# EAGLE schematic aquam60 (EAGLE 9.6.2)
DOCO_NUMBER: 4014 003; REV: 03; TITLE: AQUA M60

## Sheet 1 of 6
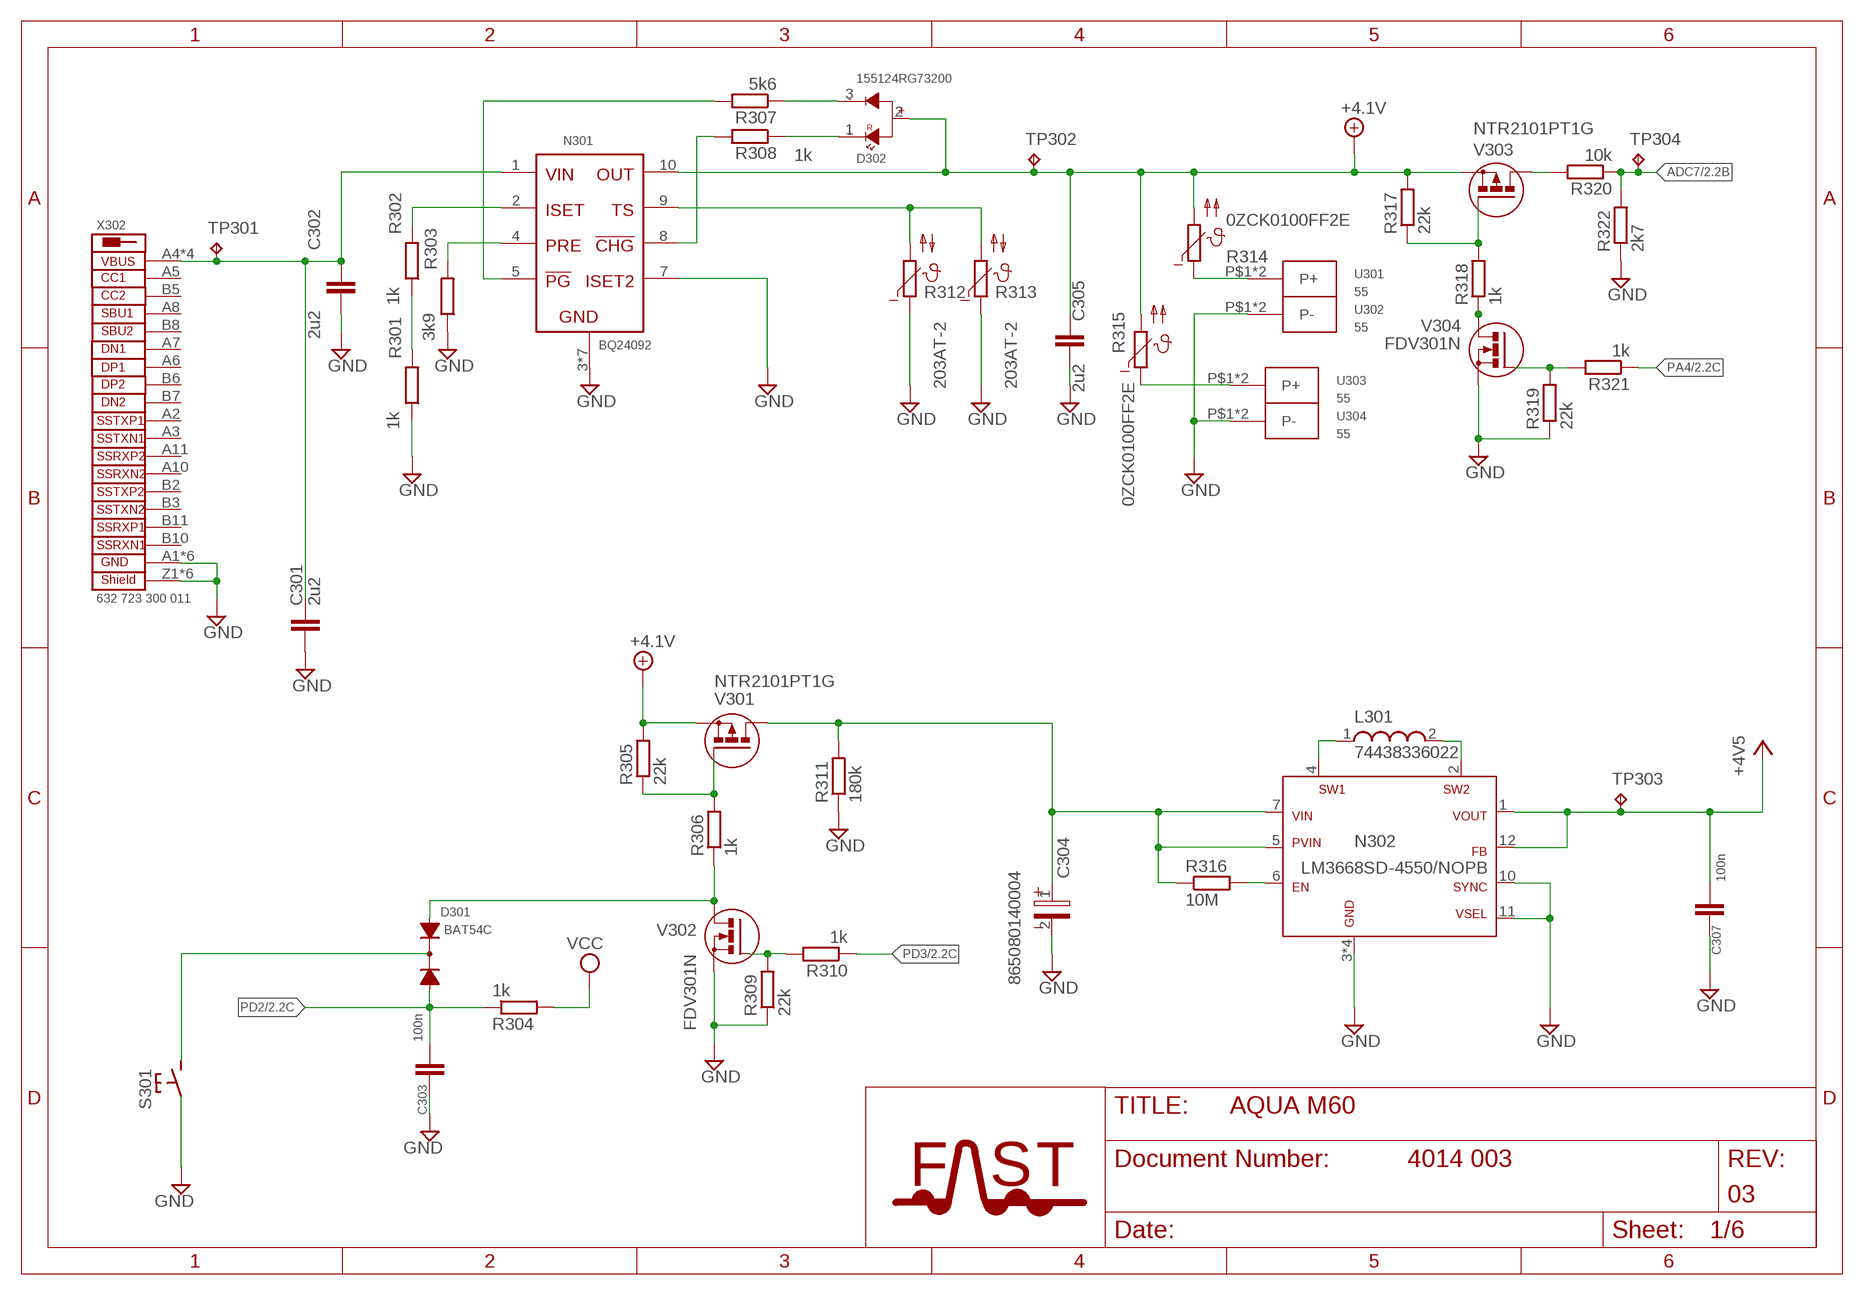
[diagram p0: schematic, sheet 1]

### Parts
C301  2u2  C-EUC0603  [C0603]
C302  2u2  C-EUC0603  [C0603]
C303  100n  C-EUC0603  [C0603]
C304  865080140004  WCAP-ASLI_4X5.5(DXL)  [2.6X1.6X1(BXCXA)]
C305  2u2  C-EUC0603  [C0603]
C307  100n  C-EUC0603  [C0603]
D301  BAT54C  BAT54C-1  [SOT23]
D302  155124RG73200  WL-SBSW_1204_155124RG73200  [WL-SBSW_1204]
L301  74438336022  WE-MAPI_3015/3020_STANDER  [WE-MAPI_3015/3020]
N301  BQ24092  BQ2409X  [HVSSOP10]
N302  LM3668SD-4550/NOPB  LM3668SD  [DFN_12POL_+0,2MM]
R301  1k  R-EU_R0603  [R0603]
R302  1k  R-EU_R0603  [R0603]
R303  3k9  R-EU_R0603  [R0603]
R304  1k  R-EU_R0603  [R0603]
R305  22k  R-EU_R0603  [R0603]
R306  1k  R-EU_R0603  [R0603]
R307  5k6  R-EU_R0603  [R0603]
R308  1k  R-EU_R0603  [R0603]
R309  22k  R-EU_R0603  [R0603]
R310  1k  R-EU_R0603  [R0603]
R311  180k  R-EU_R0603  [R0603]
R312  203AT-2  NTC  [AT-2]
R313  203AT-2  NTC  [AT-2]
R314  0ZCK0100FF2E  PTC  [R0805]
R315  0ZCK0100FF2E  PTC  [R0805]
R316  10M  R-EU_R0603  [R0603]
R317  22k  R-EU_R0603  [R0603]
R318  1k  R-EU_R0603  [R0603]
R319  22k  R-EU_R0603  [R0603]
R320  10k  R-EU_R0603  [R0603]
R321  1k  R-EU_R0603  [R0603]
R322  2k7  R-EU_R0603  [R0603]
S301  1301.9320  1301.93XX  [1301.93XX]
TP301  n.b.  TPTP10R  [TP10R]
TP302  n.b.  TPTP10R  [TP10R]
TP303  n.b.  TPTP10R  [TP10R]
TP304  n.b.  TPTP10R  [TP10R]
U301  55  55+  [55+]
U302  55  55--  [55-]
U303  55  55+  [55+]
U304  55  55--  [55-]
V301  NTR2101PT1G  P-MOSFET-SOT23  [SMDTR-1]
V302  FDV301N  N-MOSFET-SOT23  [SMDTR-1]
V303  NTR2101PT1G  P-MOSFET-SOT23  [SMDTR-1]
V304  FDV301N  N-MOSFET-SOT23  [SMDTR-1]
X302  632 723 300 011  USB_3.1_TYPE_C_4L  [632723300011_4L]

### Nets
+4.1V [V+]: C305.1 D302.2 N301.10(OUT) R305.2 R314.2 R315.2 R317.2 TP302.TP V301.2(S) V303.2(S)
+4V5 [VCC]: C307.2 N302.1(VOUT) N302.12(FB) TP303.TP ; also sheet 2,3,4
ADC7: R320.1 R322.2 TP304.TP ; also sheet 2
GND [GND]: C301.2 C302.2 C303.1 C304.2 C305.2 C307.1 N301.3(GND) N301.7(ISET2) N301.11(GND) N301.P$1(GND) N301.P$2(GND) N301.P$3(GND) N301.P$4(GND) N301.P$5(GND) N302.3(GND) N302.8(GND) N302.9(GND) N302.10(SYNC) N302.11(VSEL) N302.13(GND) R301.1 R303.1 R309.1 R311.1 R312.P$1 R313.P$1 R319.1 R322.1 S301.P1 S301.P2 U302.P$1(P-) U302.P$2(P-) U304.P$1(P-) U304.P$2(P-) V302.2(S) V304.2(S) X302.A1(GND) X302.A12(GND) X302.B1(GND) X302.B12(GND) X302.G3(GND) X302.G4(GND) X302.Z1(SHIELD) X302.Z2(SHIELD) X302.Z3(SHIELD) X302.Z4(SHIELD) X302.Z5(SHIELD) X302.Z6(SHIELD) ; also sheet 2,3,4,5,6
N$6: D302.3 R307.1
N$7: D302.1 R308.1
N$10: N301.8(!CHG!) R308.2
N$28 [V+]: R314.1 U301.P$1(P+) U301.P$2(P+)
N$29: C304.1 N302.5(PVIN) N302.7(VIN) R311.2 R316.1 V301.3(D)
N$32: D301.3(AK) S301.P3 S301.P4
N$40: R318.1 V304.3(D)
N$44: R317.1 R318.2 V303.1(G)
N$45: R319.2 R321.2 V304.1(G)
N$46 [V+]: C301.1 C302.1 N301.1(VIN) TP301.TP X302.A4(VBUS) X302.A9(VBUS) X302.B4(VBUS) X302.B9(VBUS)
N$47: N301.2(ISET) R302.2
N$48: R320.2 V303.3(D)
N$49: N301.4(PRE) R303.2
N$51: N301.9(TS) R312.P$2 R313.P$2
N$55: N301.5(!PG!) R307.2
N$56: N302.6(EN) R316.2
N$64: R305.1 R306.2 V301.1(G)
N$65: L301.1 N302.4(SW1)
N$66: D301.2(A2) R306.1 V302.3(D)
N$67: R309.2 R310.2 V302.1(G)
N$71: L301.2 N302.2(SW2)
N$73: R315.1 U303.P$1(P+) U303.P$2(P+)
N$74: R301.2 R302.1
PA4: R321.1 ; also sheet 2
PD2: C303.2 D301.1(A1) R304.1 ; also sheet 2
PD3: R310.1 ; also sheet 2
VCC [VCC]: R304.2 ; also sheet 2,4
Unconnected: X302.A2(SSTXP1) X302.A3(SSTXN1) X302.A5(CC1) X302.A6(DP1) X302.A7(DN1) X302.A8(SBU1) X302.A10(SSRXN2) X302.A11(SSRXP2) X302.B2(SSTXP2) X302.B3(SSTXN2) X302.B5(CC2) X302.B6(DP2) X302.B7(DN2) X302.B8(SBU2) X302.B10(SSRXN1) X302.B11(SSRXP1)

## Sheet 2 of 6
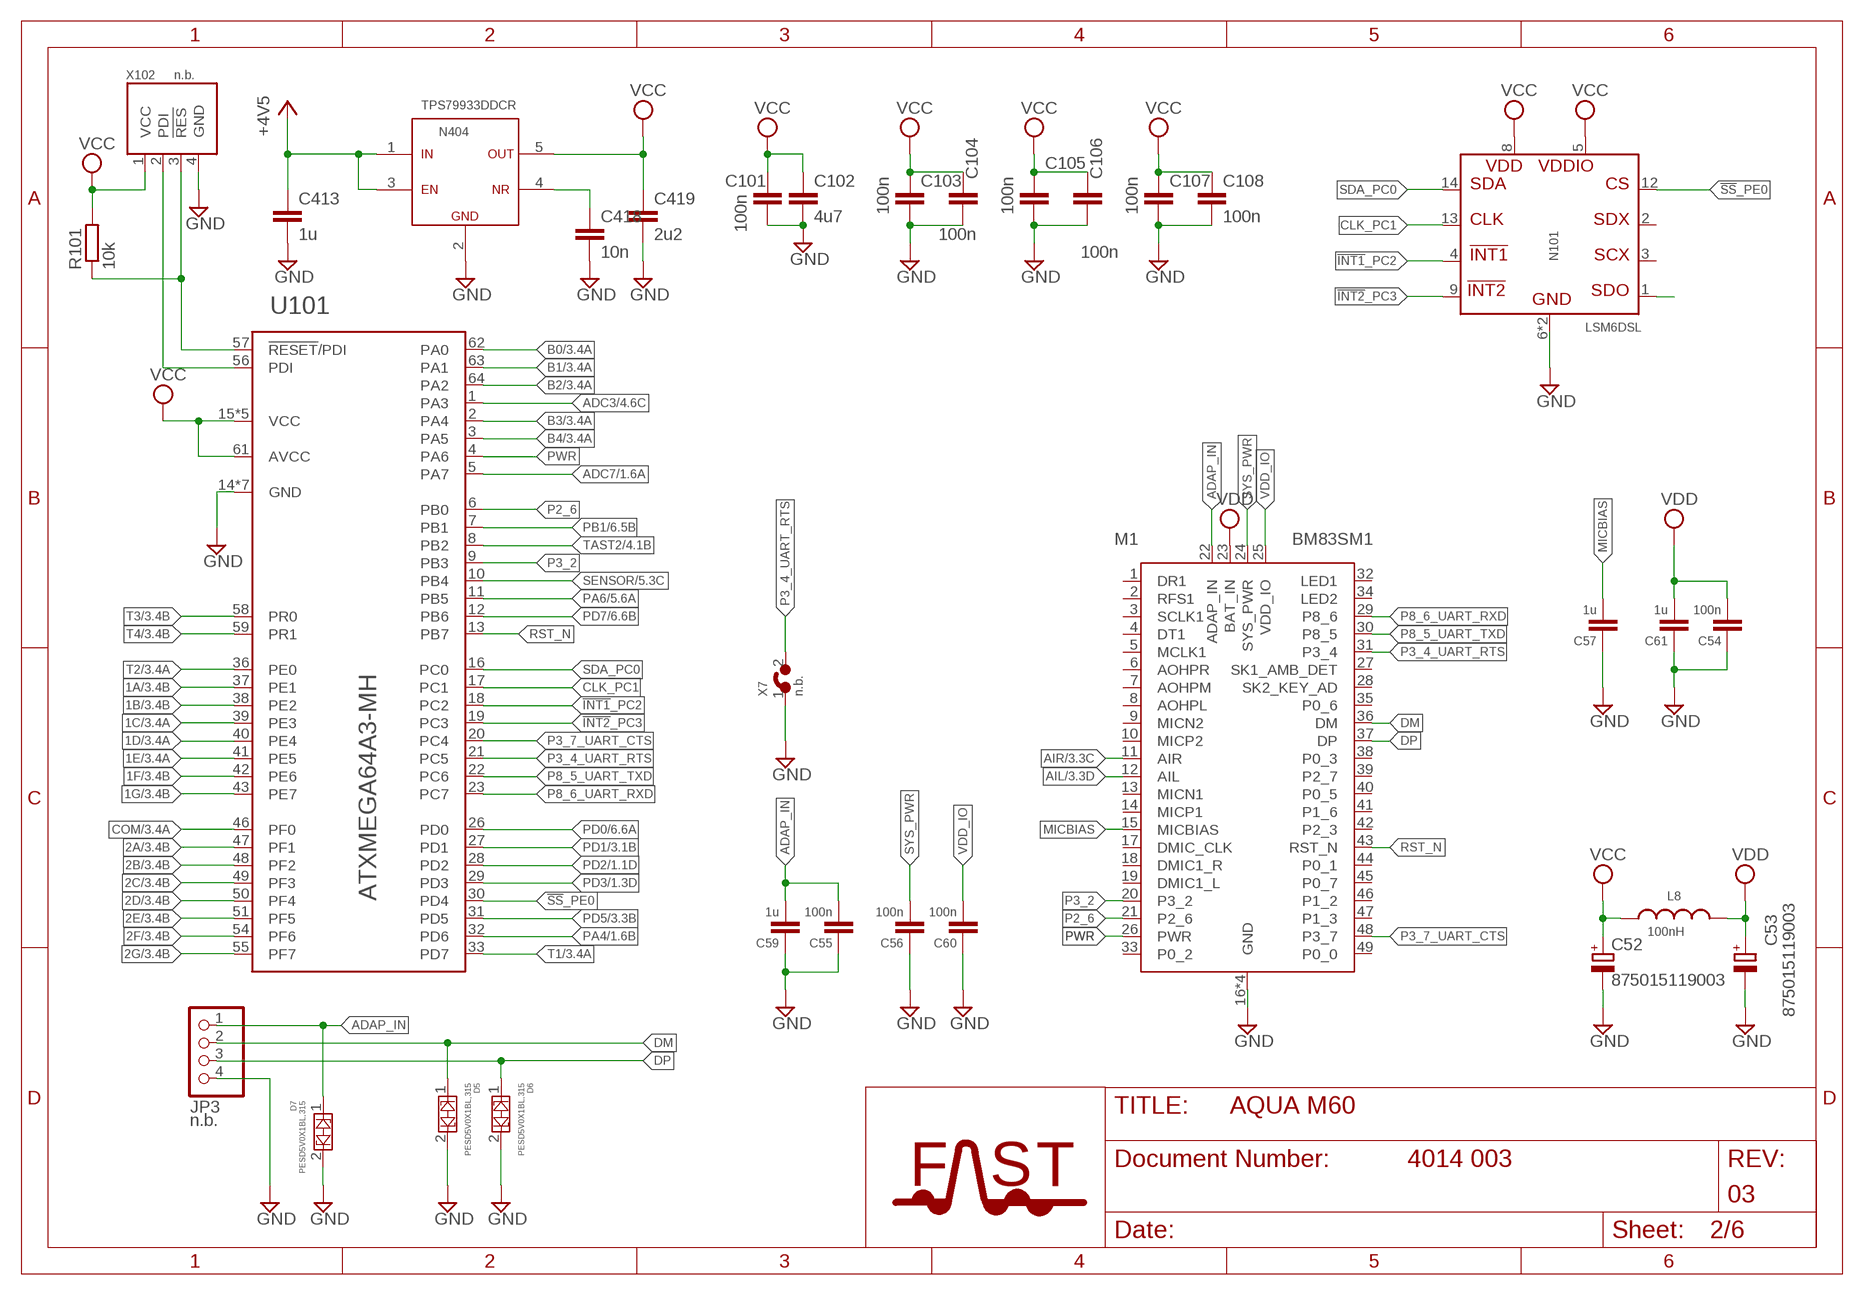
[diagram p1: schematic, sheet 2]

### Parts
C52  875015119003  KONDENSATOR_WE_WCAP_PHET_7,3X4,3X1,9MM  [WE_WCAP-PHGP]
C53  875015119003  KONDENSATOR_WE_WCAP_PHET_7,3X4,3X1,9MM  [WE_WCAP-PHGP]
C54  100n  C-EUC0603  [C0603]
C55  100n  C-EUC0603  [C0603]
C56  100n  C-EUC0603  [C0603]
C57  1u  C-EUC0603  [C0603]
C59  1u  C-EUC0603  [C0603]
C60  100n  C-EUC0603  [C0603]
C61  1u  C-EUC0603  [C0603]
C101  100n  C-EUC0603  [C0603]
C102  4u7  C-EUC0603  [C0603]
C103  100n  C-EUC0603  [C0603]
C104  100n  C-EUC0603  [C0603]
C105  100n  C-EUC0603  [C0603]
C106  100n  C-EUC0603  [C0603]
C107  100n  C-EUC0603  [C0603]
C108  100n  C-EUC0603  [C0603]
C413  1u  C-EUC0603  [C0603]
C418  10n  C-EUC0603  [C0603]
C419  2u2  C-EUC0603  [C0603]
D5  PESD5V0X1BL,315  [DIODFN100X60X60-2]
D6  PESD5V0X1BL,315  [DIODFN100X60X60-2]
D7  PESD5V0X1BL,315  [DIODFN100X60X60-2]
JP3  n.b.  PINHD-1X4  [1X04]
L8  100nH  WE-KI_0805_744760210A  [WE-KI_0805]
M1  BM83SM1  BM83  [BM83]
N101  LSM6DSL  LSM6DSLTR  [LGA-14]
N404  TPS79933DDCR  TPS79933  [SOT-23-5]
R101  10k  R-EU_R0603  [R0603]
U101  ATXMEGA64A3-MH  [MLF-(VQFN)-64M2-64]
X7  n.b.  LB1_2  [LöTBRüCKE_2]
X102  n.b.  AVRPDI  [AVRPDI4]

### Nets
1A: U101.37(PE1) ; also sheet 3
1B: U101.38(PE2) ; also sheet 3
1C: U101.39(PE3) ; also sheet 3
1D: U101.40(PE4) ; also sheet 3
1E: U101.41(PE5) ; also sheet 3
1F: U101.42(PE6) ; also sheet 3
1G: U101.43(PE7) ; also sheet 3
2A: U101.47(PF1) ; also sheet 3
2B: U101.48(PF2) ; also sheet 3
2C: U101.49(PF3) ; also sheet 3
2D: U101.50(PF4) ; also sheet 3
2E: U101.51(PF5) ; also sheet 3
2F: U101.54(PF6) ; also sheet 3
2G: U101.55(PF7) ; also sheet 3
!INT1!_PC2: N101.4(!INT1!) U101.18(PC2)
!INT2!_PC3: N101.9(!INT2!) U101.19(PC3)
!SS!_PE0: N101.12(CS) U101.30(PD4)
+4V5 [VCC]: C413.1 N404.1(IN) N404.3(EN) ; also sheet 1,3,4
ADAP_IN: C55.2 C59.2 D7.1 JP3.1 M1.22(ADAP_IN)
ADC3 [VCC]: U101.1(PA3) ; also sheet 4
ADC7: U101.5(PA7) ; also sheet 1
AIL: M1.12(AIL) ; also sheet 3
AIR: M1.11(AIR) ; also sheet 3
B0: U101.62(PA0) ; also sheet 3
B1: U101.63(PA1) ; also sheet 3
B2: U101.64(PA2) ; also sheet 3
B3: U101.2(PA4) ; also sheet 3
B4: U101.3(PA5) ; also sheet 3
CLK_PC1: N101.13(SCL) U101.17(PC1)
COM: U101.46(PF0) ; also sheet 3
DM: D5.1 JP3.2 M1.36(DM)
DP: D6.1 JP3.3 M1.37(DP)
GND [GND]: C52.1-(-) C53.1-(-) C54.1 C55.1 C56.1 C57.1 C59.1 C60.1 C61.1 C101.2 C102.2 C103.2 C104.2 C105.2 C106.2 C107.2 C108.2 C413.2 C418.2 C419.2 D5.2 D6.2 D7.2 JP3.4 M1.16(GND) M1.50(GND) M1.56(GND) M1.57(GND) N101.6(GND) N101.7(GND) N404.2(GND) U101.14(GND) U101.24(GND) U101.34(GND) U101.44(GND) U101.52(GND) U101.60(GND) U101.TH(GND) X7.1(IN) X102.4(GND) ; also sheet 1,3,4,5,6
MICBIAS: C57.2 M1.15(MICBIAS)
N$35: C418.1 N404.4(NR)
N$38: U101.56(PDI) X102.2(PDI)
N$39: R101.1 U101.57(!RESET!/PDI) X102.3(!RES!)
N$54: N101.1(SDO)
P2_6: M1.21(P2_6) U101.6(PB0)
P3_2: M1.20(P3_2) U101.9(PB3)
P3_4_UART_RTS: M1.31(P3_4) U101.21(PC5) X7.2(OUT)
P3_7_UART_CTS: M1.48(P3_7) U101.20(PC4)
P8_5_UART_TXD: M1.30(P8_5) U101.22(PC6)
P8_6_UART_RXD: M1.29(P8_6) U101.23(PC7)
PA4: U101.32(PD6) ; also sheet 1
PA6: U101.11(PB5) ; also sheet 5
PB1: U101.7(PB1) ; also sheet 6
PD0: U101.26(PD0) ; also sheet 6
PD1: U101.27(PD1) ; also sheet 3
PD2: U101.28(PD2) ; also sheet 1
PD3: U101.29(PD3) ; also sheet 1
PD5: U101.31(PD5) ; also sheet 3
PD7: U101.12(PB6) ; also sheet 6
PWR: M1.26(PWR) U101.4(PA6)
RST_N: M1.43(RST_N) U101.13(PB7)
SDA_PC0: N101.14(SDA) U101.16(PC0)
SENSOR: U101.10(PB4) ; also sheet 5
SYS_PWR: C56.2 M1.24(SYS_PWR)
T1: U101.33(PD7) ; also sheet 3
T2: U101.36(PE0) ; also sheet 3
T3: U101.58(PR0) ; also sheet 3
T4: U101.59(PR1) ; also sheet 3
TAST2: U101.8(PB2) ; also sheet 4
VCC [VCC]: C52.2+(+) C101.1 C102.1 C103.1 C104.1 C105.1 C106.1 C107.1 C108.1 C419.1 L8.1 N101.5(VDDIO) N101.8(VDD) N404.5(OUT) R101.2 U101.15(VCC) U101.25(VCC) U101.35(VCC) U101.45(VCC) U101.53(VCC) U101.61(AVCC) X102.1(VCC) ; also sheet 1,4
VDD: C53.2+(+) C54.2 C61.2 L8.2 M1.23(BAT_IN)
VDD_IO: C60.2 M1.25(VDD_IO)
Unconnected: M1.1(DR1) M1.2(RFS1) M1.3(SCLK1) M1.4(DT1) M1.5(MCLK1) M1.6(AOHPR) M1.7(AOHPM) M1.8(AOHPL) M1.9(MICN2) M1.10(MICP2) M1.13(MICN1) M1.14(MICP1) M1.17(DMIC_CLK) M1.18(DMIC1_R) M1.19(DMIC1_L) M1.27(SK1_AMB_DET) M1.28(SK2_KEY_AD) M1.32(LED1) M1.33(P0_2) M1.34(LED2) M1.35(P0_6) M1.38(P0_3) M1.39(P2_7) M1.40(P0_5) M1.41(P1_6) M1.42(P2_3) M1.44(P0_1) M1.45(P0_7) M1.46(P1_2) M1.47(P1_3) M1.49(P0_0) N101.2(SDX) N101.3(SCX)

## Sheet 3 of 6
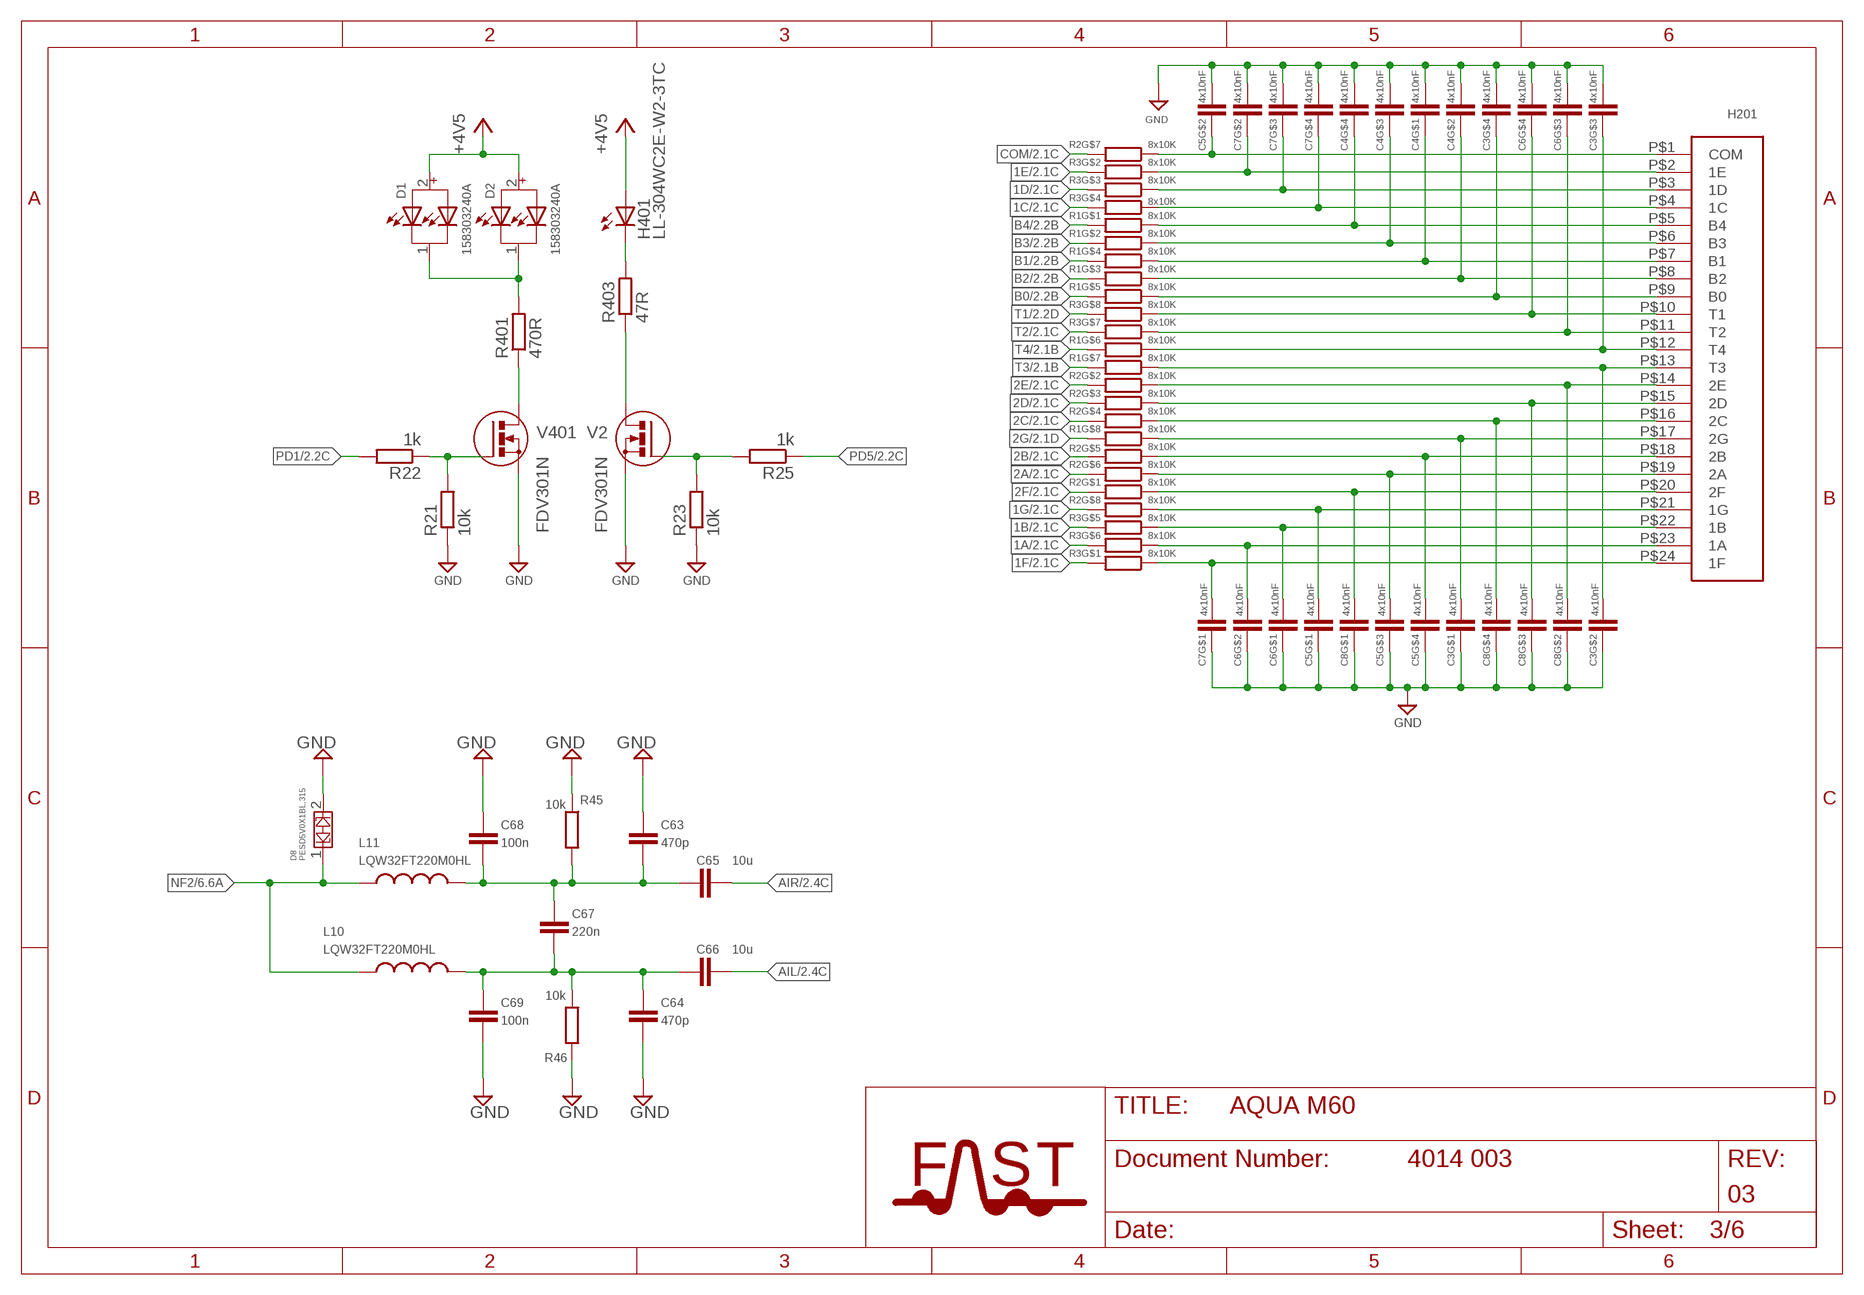
[diagram p2: schematic, sheet 3]

### Parts
C3  4x10nF  C_ARRAY_4X  [C0612]
C4  4x10nF  C_ARRAY_4X  [C0612]
C5  4x10nF  C_ARRAY_4X  [C0612]
C6  4x10nF  C_ARRAY_4X  [C0612]
C7  4x10nF  C_ARRAY_4X  [C0612]
C8  4x10nF  C_ARRAY_4X  [C0612]
C63  470p  C-EUC0603  [C0603]
C64  470p  C-EUC0603  [C0603]
C65  10u  C-EUC0805  [C0805]
C66  10u  C-EUC0805  [C0805]
C67  220n  C-EUC0603  [C0603]
C68  100n  C-EUC0603  [C0603]
C69  100n  C-EUC0603  [C0603]
D1  158303240A  WL-SWTP_3030_158303240A  [WL-SWTP_3030]
D2  158303240A  WL-SWTP_3030_158303240A  [WL-SWTP_3030]
D8  PESD5V0X1BL,315  [DIODFN100X60X60-2]
H201  AQUAM60  [AQUAM60]
H401  LL-304WC2E-W2-3TC  LED  [LED3MM_H7,5MM]
L10  LQW32FT220M0HL  [INDC3225X250N]
L11  LQW32FT220M0HL  [INDC3225X250N]
R1  8x10K  R_ARRAY_8X  [R1506]
R2  8x10K  R_ARRAY_8X  [R1506]
R3  8x10K  R_ARRAY_8X  [R1506]
R21  10k  R-EU_R0603  [R0603]
R22  1k  R-EU_R0603  [R0603]
R23  10k  R-EU_R0603  [R0603]
R25  1k  R-EU_R0603  [R0603]
R45  10k  R-EU_R0603  [R0603]
R46  10k  R-EU_R0603  [R0603]
R401  470R  R-EU_R0805  [R0805]
R403  47R  R-EU_R0805  [R0805]
V2  FDV301N  N-MOSFET-SOT23  [SMDTR-1]
V401  FDV301N  N-MOSFET-SOT23  [SMDTR-1]

### Nets
1A: R3.12 ; also sheet 2
1B: R3.10 ; also sheet 2
1C: R3.8 ; also sheet 2
1D: R3.6 ; also sheet 2
1E: R3.4 ; also sheet 2
1F: R3.2 ; also sheet 2
1G: R2.16 ; also sheet 2
2A: R2.12 ; also sheet 2
2B: R2.10 ; also sheet 2
2C: R2.8 ; also sheet 2
2D: R2.6 ; also sheet 2
2E: R2.4 ; also sheet 2
2F: R2.2 ; also sheet 2
2G: R1.16 ; also sheet 2
+4V5 [VCC]: D1.2(+) D2.2(+) H401.A ; also sheet 1,2,4
AIL: C66.1 ; also sheet 2
AIR: C65.1 ; also sheet 2
B0: R1.10 ; also sheet 2
B1: R1.8 ; also sheet 2
B2: R1.6 ; also sheet 2
B3: R1.4 ; also sheet 2
B4: R1.2 ; also sheet 2
COM: R2.14 ; also sheet 2
GND [GND]: C3.2 C3.4 C3.6 C3.8 C4.2 C4.4 C4.6 C4.8 C5.2 C5.4 C5.6 C5.8 C6.1 C6.3 C6.5 C6.7 C7.1 C7.3 C7.5 C7.7 C8.1 C8.3 C8.5 C8.7 C63.2 C64.1 C68.2 C69.1 D8.2 R21.1 R23.1 R45.1 R46.2 V2.2(S) V401.2(S) ; also sheet 1,2,4,5,6
N$1: H401.K(C) R403.2
N$4: R401.1 V401.3(D)
N$15: D1.1(-) D2.1(-) R401.2
N$25: C4.1 H201.P$7(B1) R1.7
N$37: C63.1 C65.2 C67.2 C68.1 L11.2 R45.2
N$63: R21.2 R22.1 V401.1(G)
N$68: R23.2 R25.2 V2.1(G)
N$85: C6.2 H201.P$22(1B) R3.9
N$86: C6.4 H201.P$23(1A) R3.11
N$87: C6.6 H201.P$11(T2) R3.13
N$88: C6.8 H201.P$10(T1) R3.15
N$89: C7.2 H201.P$24(1F) R3.1
N$90: C7.4 H201.P$2(1E) R3.3
N$91: C7.6 H201.P$3(1D) R3.5
N$92: C7.8 H201.P$4(1C) R3.7
N$93: C8.2 H201.P$20(2F) R2.1
N$94: C8.4 H201.P$14(2E) R2.3
N$95: C8.6 H201.P$15(2D) R2.5
N$96: C8.8 H201.P$16(2C) R2.7
N$109: R403.1 V2.3(D)
N$116: C64.2 C66.2 C67.1 C69.2 L10.2 R46.1
N$123: C3.1 H201.P$17(2G) R1.15
N$126: C3.3 H201.P$13(T3) R1.13
N$127: C3.5 H201.P$12(T4) R1.11
N$128: C5.1 H201.P$21(1G) R2.15
N$130: C4.3 H201.P$8(B2) R1.5
N$131: C4.5 H201.P$6(B3) R1.3
N$132: C4.7 H201.P$5(B4) R1.1
N$133: C3.7 H201.P$9(B0) R1.9
N$134: C5.3 H201.P$1(COM) R2.13
N$135: C5.5 H201.P$19(2A) R2.11
N$136: C5.7 H201.P$18(2B) R2.9
NF2: D8.1 L10.1 L11.1 ; also sheet 6
PD1: R22.2 ; also sheet 2
PD5: R25.1 ; also sheet 2
T1: R3.16 ; also sheet 2
T2: R3.14 ; also sheet 2
T3: R1.14 ; also sheet 2
T4: R1.12 ; also sheet 2

## Sheet 4 of 6
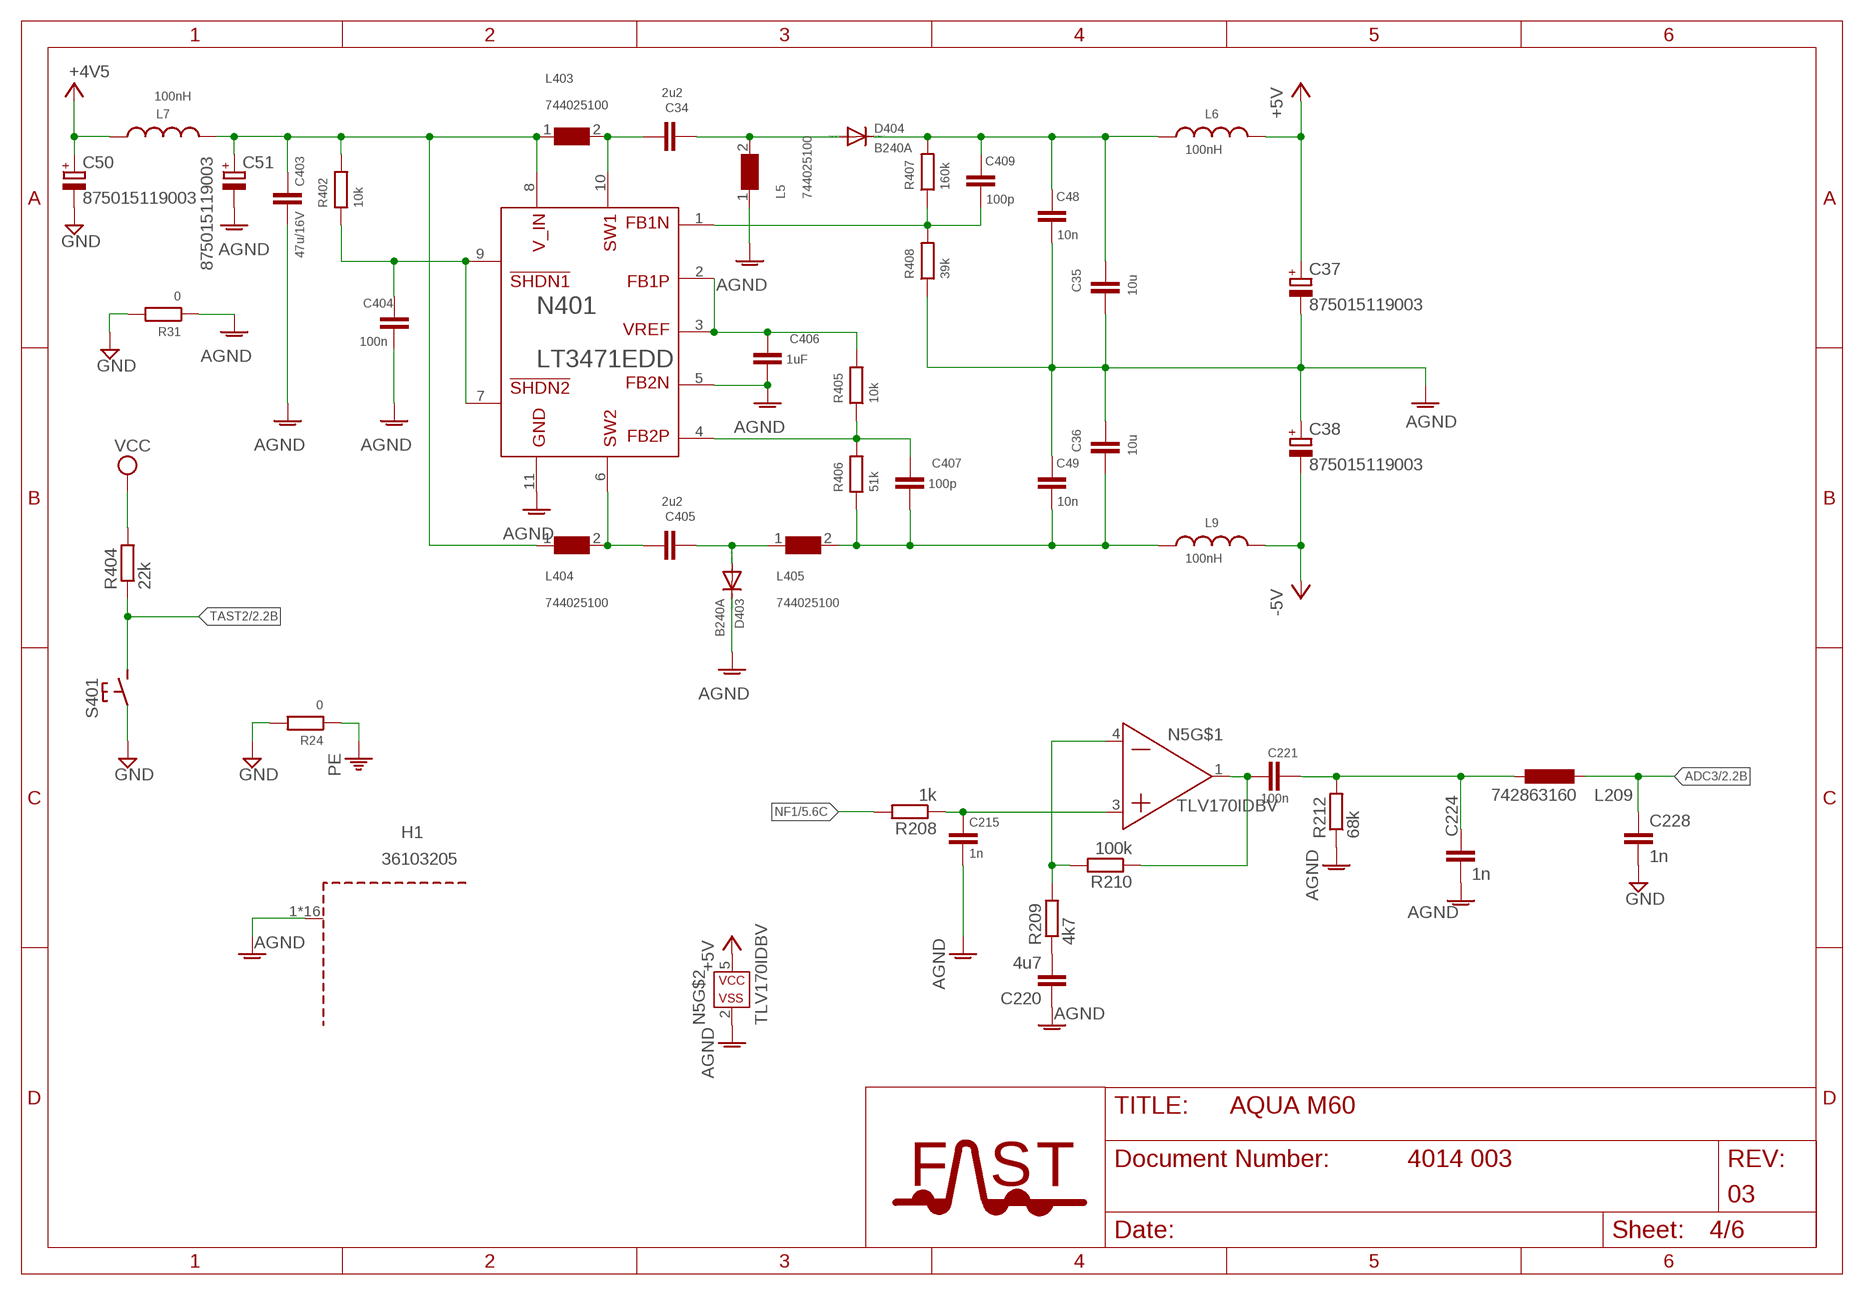
[diagram p3: schematic, sheet 4]

### Parts
C34  2u2  C-EUC0603  [C0603]
C35  10u  C-EUC1210  [C1210]
C36  10u  C-EUC1210  [C1210]
C37  875015119003  KONDENSATOR_WE_WCAP_PHET_7,3X4,3X1,9MM  [WE_WCAP-PHGP]
C38  875015119003  KONDENSATOR_WE_WCAP_PHET_7,3X4,3X1,9MM  [WE_WCAP-PHGP]
C48  10n  C-EUC0603  [C0603]
C49  10n  C-EUC0603  [C0603]
C50  875015119003  KONDENSATOR_WE_WCAP_PHET_7,3X4,3X1,9MM  [WE_WCAP-PHGP]
C51  875015119003  KONDENSATOR_WE_WCAP_PHET_7,3X4,3X1,9MM  [WE_WCAP-PHGP]
C215  1n  C-EUC0603  [C0603]
C220  4u7  C-EUC0805  [C0805]
C221  100n  C-EUC0805  [C0805]
C224  1n  C-EUC0603  [C0603]
C228  1n  C-EUC0603  [C0603]
C403  47u/16V  C-EUC1210  [C1210]
C404  100n  C-EUC0603  [C0603]
C405  2u2  C-EUC0603  [C0603]
C406  1uF  C-EUC0603  [C0603]
C407  100p  C-EUC0603  [C0603]
C409  100p  C-EUC0603  [C0603]
D403  B240A  DIODE-DO214AC  [DO214AC]
D404  B240A  DIODE-DO214AC  [DO214AC]
H1  36103205  WE-SHC_SMD-FRAME_36103205  [WE-SHC_SMD-FRAME_36103205]
L5  744025100  WE-TPC_2811/2813  [WE-TPC_2811/2813]
L6  100nH  WE-KI_0805_744760210A  [WE-KI_0805]
L7  100nH  WE-KI_0805_744760210A  [WE-KI_0805]
L9  100nH  WE-KI_0805_744760210A  [WE-KI_0805]
L209  742863160  L-EUR0603  [R0603]
L403  744025100  WE-TPC_2811/2813  [WE-TPC_2811/2813]
L404  744025100  WE-TPC_2811/2813  [WE-TPC_2811/2813]
L405  744025100  WE-TPC_2811/2813  [WE-TPC_2811/2813]
N5  TLV170IDBV  OPV_1SOT23-3  [SOT-23L]
N401  LT3471EDD  LT3471  [DFN_10POL_3X3MM+0,2MM]
R24  0  R-EU_R0603  [R0603]
R31  0  R-EU_R0603  [R0603]
R208  1k  R-EU_R0603  [R0603]
R209  4k7  R-EU_R0603  [R0603]
R210  100k  R-EU_R0603  [R0603]
R212  68k  R-EU_R0603  [R0603]
R402  10k  R-EU_R0603  [R0603]
R404  22k  R-EU_R0603  [R0603]
R405  10k  R-EU_R0603  [R0603]
R406  51k  R-EU_R0603  [R0603]
R407  160k  R-EU_R0603  [R0603]
R408  39k  R-EU_R0603  [R0603]
S401  1301.9320  1301.93XX  [1301.93XX]

### Nets
+4V5 [VCC]: C50.2+(+) L7.1 ; also sheet 1,2,3
+5V: C37.2+(+) L6.2 N5.5(VCC) ; also sheet 5,6
-5V: C38.1-(-) L9.2 ; also sheet 5,6
ADC3 [VCC]: C228.1 L209.2 ; also sheet 2
AGND [AGND]: C35.2 C36.1 C37.1-(-) C38.2+(+) C48.2 C49.1 C51.1-(-) C215.2 C220.1 C224.2 C403.2 C404.2 C406.2 D403.C H1.1(GND) H1.2(GND) H1.3(GND) H1.4(GND) H1.5(GND) H1.6(GND) H1.7(GND) H1.8(GND) H1.9(GND) H1.10(GND) H1.11(GND) H1.12(GND) H1.13(GND) H1.14(GND) H1.15(GND) H1.16(GND) L5.1 N5.2(VSS) N401.5(FB2N) N401.11(GND) R31.1 R212.1 R408.1 ; also sheet 5,6
GND [GND]: C50.1-(-) C228.2 R24.2 R31.2 S401.P1 S401.P2 ; also sheet 1,2,3,5,6
N$2: C51.2+(+) C403.1 L7.2 L403.1 L404.1 N401.8(V_IN) R402.2
N$21: N5.4(IN-) R209.2 R210.2
N$24: C221.2 N5.1(OUT) R210.1
N$26: C220.2 R209.1
N$27: C215.1 N5.3(IN+) R208.1
N$31: C36.2 C49.2 C407.2 L9.1 L405.2 R406.1
N$50: C221.1 C224.1 L209.1 R212.2
N$62: C35.1 C48.1 C409.1 D404.C L6.1 R407.2
N$106: C404.1 N401.7(!SHDN2!) N401.9(!SHDN1!) R402.1
N$108: C405.2 L404.2 N401.6(SW2)
N$110: C405.1 D403.A L405.1
N$111: C34.2 L403.2 N401.10(SW1)
N$112: C34.1 D404.A L5.2
N$182: C409.2 N401.1(FB1N) R407.1 R408.2
N$183: C407.1 N401.4(FB2P) R405.1 R406.2
N$185: C406.1 N401.2(FB1P) N401.3(VREF) R405.2
NF1: R208.2 ; also sheet 5,6
PE [PE]: R24.1
TAST2: R404.1 S401.P3 S401.P4 ; also sheet 2
VCC [VCC]: R404.2 ; also sheet 1,2

## Sheet 5 of 6
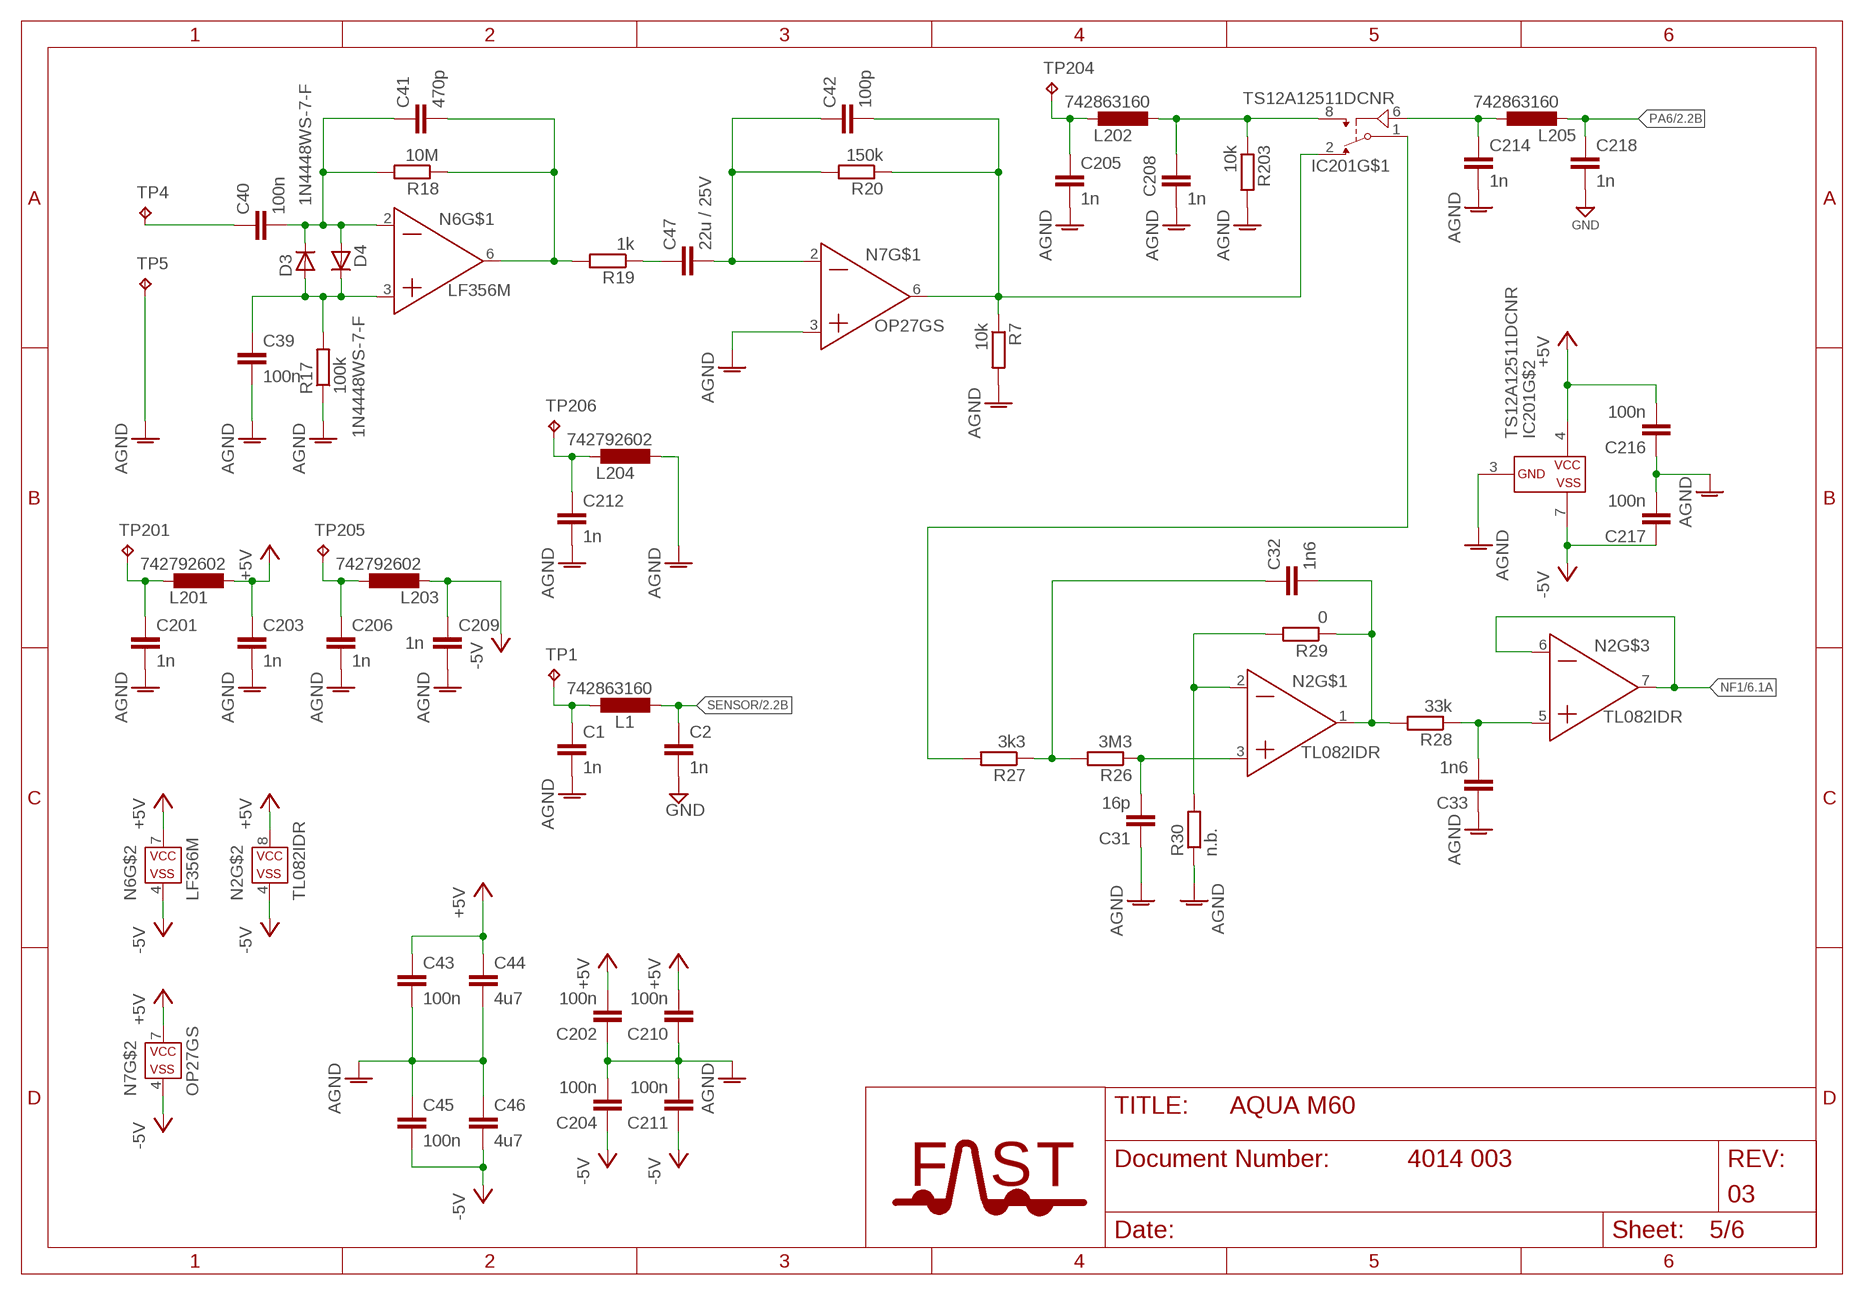
[diagram p4: schematic, sheet 5]

### Parts
C1  1n  C-EUC0603  [C0603]
C2  1n  C-EUC0603  [C0603]
C31  16p  C-EUC0603  [C0603]
C32  1n6  C-EUC0603  [C0603]
C33  1n6  C-EUC0603  [C0603]
C39  100n  C-EUC0805  [C0805]
C40  100n  C-EUC0805  [C0805]
C41  470p  C-EUC0805  [C0805]
C42  100p  C-EUC0805  [C0805]
C43  100n  C-EUC0603  [C0603]
C44  4u7  C-EUC0805  [C0805]
C45  100n  C-EUC0603  [C0603]
C46  4u7  C-EUC0805  [C0805]
C47  22u / 25V  C-EUC1210  [C1210]
C201  1n  C-EUC0603  [C0603]
C202  100n  C-EUC0603  [C0603]
C203  1n  C-EUC0603  [C0603]
C204  100n  C-EUC0603  [C0603]
C205  1n  C-EUC0603  [C0603]
C206  1n  C-EUC0603  [C0603]
C208  1n  C-EUC0603  [C0603]
C209  1n  C-EUC0603  [C0603]
C210  100n  C-EUC0603  [C0603]
C211  100n  C-EUC0603  [C0603]
C212  1n  C-EUC0603  [C0603]
C214  1n  C-EUC0603  [C0603]
C216  100n  C-EUC0603  [C0603]
C217  100n  C-EUC0603  [C0603]
C218  1n  C-EUC0603  [C0603]
D3  1N4448WS-7-F  1N4448  [SOD-323]
D4  1N4448WS-7-F  1N4448  [SOD-323]
IC201  TS12A12511DCNR  TS12A12511DCN  [SOT-23-8]
L1  742863160  L-EUR0603  [R0603]
L201  742792602  L-EUR0603  [R0603]
L202  742863160  L-EUR0603  [R0603]
L203  742792602  L-EUR0603  [R0603]
L204  742792602  L-EUR0603  [R0603]
L205  742863160  L-EUR0603  [R0603]
N2  TL082IDR  OPV_2  [SO-8]
N6  LF356M  OPV_1  [SO-8]
N7  OP27GS  OPV_1  [SO-8]
R7  10k  R-EU_R0603  [R0603]
R17  100k  R-EU_R0805  [R0805]
R18  10M  R-EU_R0805  [R0805]
R19  1k  R-EU_R0805  [R0805]
R20  150k  R-EU_R0805  [R0805]
R26  3M3  R-EU_R0603  [R0603]
R27  3k3  R-EU_R0603  [R0603]
R28  33k  R-EU_R0603  [R0603]
R29  0  R-EU_R0603  [R0603]
R30  n.b.  R-EU_R0603  [R0603]
R203  10k  R-EU_R0603  [R0603]
TP1  n.b.  TPB0,80  [P1-08]
TP4  n.b.  TPPAD1-13R  [P1-13R]
TP5  n.b.  TPPAD1-20  [P1-20]
TP201  n.b.  TPB0,80  [P1-08]
TP204  n.b.  TPB0,80  [P1-08]
TP205  n.b.  TPB0,80  [P1-08]
TP206  n.b.  TPB0,80  [P1-08]

### Nets
+5V: C43.1 C44.1 C202.2 C203.1 C210.2 C216.2 IC201.4(VCC) L201.2 N2.8(VCC) N6.7(VCC) N7.7(VCC) ; also sheet 4,6
-5V: C45.2 C46.2 C204.1 C209.1 C211.1 C217.1 IC201.7(VSS) L203.2 N2.4(VSS) N6.4(VSS) N7.4(VSS) ; also sheet 4,6
AGND [AGND]: C1.2 C31.1 C33.1 C39.2 C43.2 C44.2 C45.1 C46.1 C201.2 C202.1 C203.2 C204.2 C205.2 C206.2 C208.2 C209.2 C210.1 C211.2 C212.2 C214.2 C216.1 C217.2 IC201.3(GND) L204.2 N7.3(IN+) R7.2 R17.1 R30.1 R203.2 TP5.TP ; also sheet 4,6
GND [GND]: C2.2 C218.2 ; also sheet 1,2,3,4,6
N$13: C1.1 L1.1 TP1.TP
N$16: C208.1 IC201.8(NO) L202.2 R203.1
N$19: C205.1 L202.1 TP204.TP
N$20: C214.1 IC201.6(IN) L205.1
N$23: C201.1 L201.1 TP201.TP
N$30: C32.1 R26.2 R27.1
N$33: C31.2 N2.3(IN+) R26.1
N$36: C33.2 N2.5(IN+) R28.1
N$61: C212.1 L204.1 TP206.TP
N$69: C32.2 N2.1(OUT) R28.2 R29.1
N$72: C206.1 L203.1 TP205.TP
N$107: IC201.1(COM) R27.2
N$113: N2.2(IN-) R29.2 R30.2
N$115: C39.1 D3.A D4.K(C) N6.3(IN+) R17.2
N$117: C40.2 C41.1 D3.K(C) D4.A N6.2(IN-) R18.2
N$118: C41.2 N6.6(OUT) R18.1 R19.2
N$119: C42.1 C47.2 N7.2(IN-) R20.2
N$120: C42.2 IC201.2(NC) N7.6(OUT) R7.1 R20.1
N$124: C47.1 R19.1
N$125: C40.1 TP4.TP
NF1: N2.6(IN-) N2.7(OUT) ; also sheet 4,6
PA6: C218.1 L205.2 ; also sheet 2
SENSOR: C2.1 L1.2 ; also sheet 2

## Sheet 6 of 6
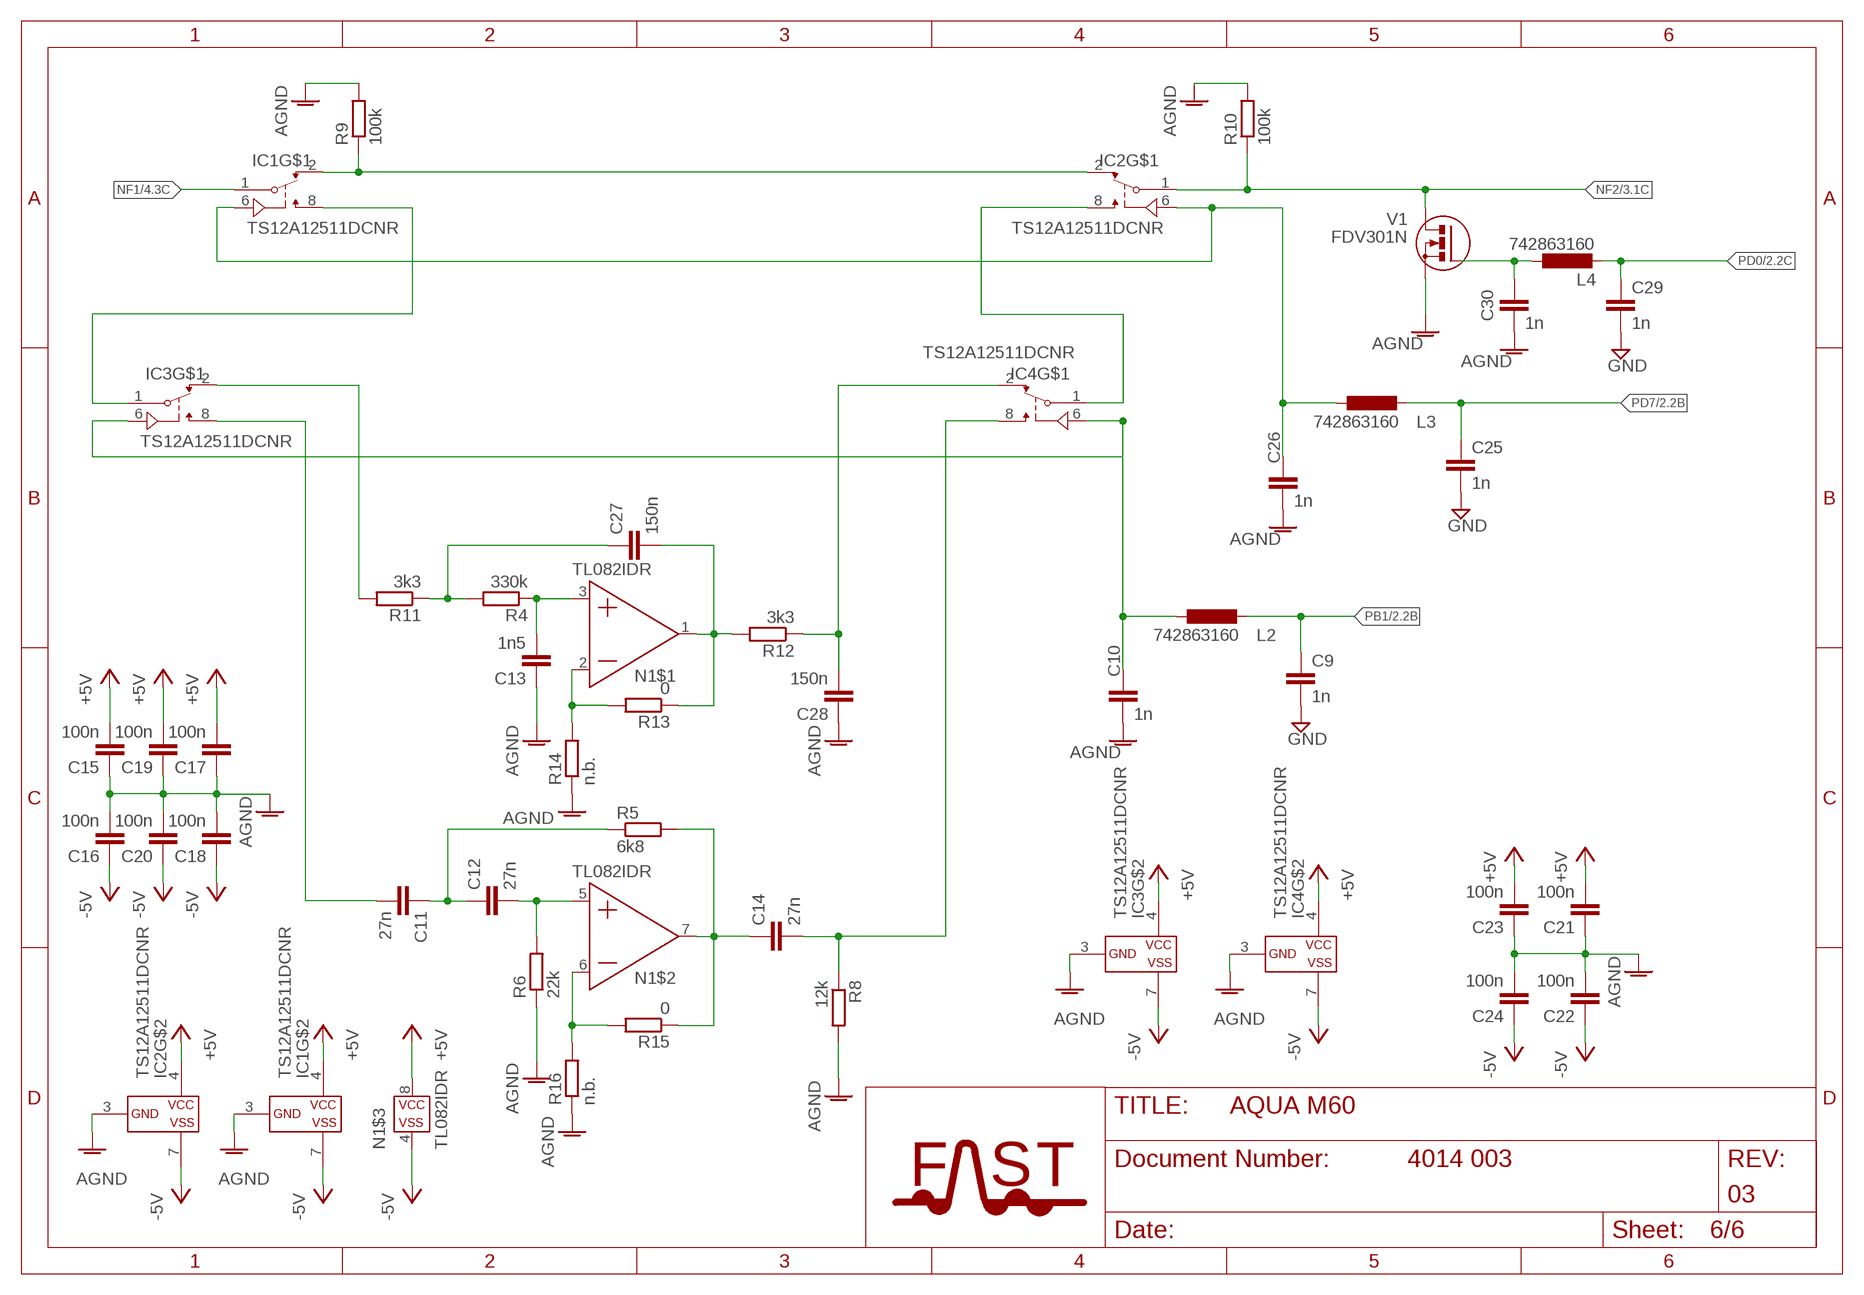
[diagram p5: schematic, sheet 6]

### Parts
C9  1n  C-EUC0603  [C0603]
C10  1n  C-EUC0603  [C0603]
C11  27n  C-EUC0603  [C0603]
C12  27n  C-EUC0603  [C0603]
C13  1n5  C-EUC0603  [C0603]
C14  27n  C-EUC0603  [C0603]
C15  100n  C-EUC0603  [C0603]
C16  100n  C-EUC0603  [C0603]
C17  100n  C-EUC0603  [C0603]
C18  100n  C-EUC0603  [C0603]
C19  100n  C-EUC0603  [C0603]
C20  100n  C-EUC0603  [C0603]
C21  100n  C-EUC0603  [C0603]
C22  100n  C-EUC0603  [C0603]
C23  100n  C-EUC0603  [C0603]
C24  100n  C-EUC0603  [C0603]
C25  1n  C-EUC0603  [C0603]
C26  1n  C-EUC0603  [C0603]
C27  150n  C-EUC0603  [C0603]
C28  150n  C-EUC0603  [C0603]
C29  1n  C-EUC0603  [C0603]
C30  1n  C-EUC0603  [C0603]
IC1  TS12A12511DCNR  TS12A12511DCN  [SOT-23-8]
IC2  TS12A12511DCNR  TS12A12511DCN  [SOT-23-8]
IC3  TS12A12511DCNR  TS12A12511DCN  [SOT-23-8]
IC4  TS12A12511DCNR  TS12A12511DCN  [SOT-23-8]
L2  742863160  L-EUR0603  [R0603]
L3  742863160  L-EUR0603  [R0603]
L4  742863160  L-EUR0603  [R0603]
N1  TL082IDR  MCP6V02  [SO-8]
R4  330k  R-EU_R0603  [R0603]
R5  6k8  R-EU_R0603  [R0603]
R6  22k  R-EU_R0603  [R0603]
R8  12k  R-EU_R0603  [R0603]
R9  100k  R-EU_R0603  [R0603]
R10  100k  R-EU_R0603  [R0603]
R11  3k3  R-EU_R0603  [R0603]
R12  3k3  R-EU_R0603  [R0603]
R13  0  R-EU_R0603  [R0603]
R14  n.b.  R-EU_R0603  [R0603]
R15  0  R-EU_R0603  [R0603]
R16  n.b.  R-EU_R0603  [R0603]
V1  FDV301N  N-MOSFET-SOT23  [SMDTR-1]

### Nets
+5V: C15.2 C17.2 C19.2 C21.2 C23.2 IC1.4(VCC) IC2.4(VCC) IC3.4(VCC) IC4.4(VCC) N1.8($3:VCC) ; also sheet 4,5
-5V: C16.1 C18.1 C20.1 C22.1 C24.1 IC1.7(VSS) IC2.7(VSS) IC3.7(VSS) IC4.7(VSS) N1.4($3:VSS) ; also sheet 4,5
AGND [AGND]: C10.2 C13.1 C15.1 C16.2 C17.1 C18.2 C19.1 C20.2 C21.1 C22.2 C23.1 C24.2 C26.2 C28.1 C30.2 IC1.3(GND) IC2.3(GND) IC3.3(GND) IC4.3(GND) R6.1 R8.2 R9.2 R10.2 R14.1 R16.1 V1.2(S) ; also sheet 4,5
GND [GND]: C9.2 C25.2 C29.2 ; also sheet 1,2,3,4,5
N$3: C10.1 IC3.6(IN) IC4.6(IN) L2.1
N$14: IC1.2(NC) IC2.2(NC) R9.1
N$17: IC1.8(NO) IC3.1(COM)
N$22: C26.1 IC1.6(IN) IC2.6(IN) L3.1
N$52: IC2.8(NO) IC4.1(COM)
N$53: C27.1 R4.2 R11.1
N$59: C13.2 N1.3($1:IN+) R4.1
N$70: N1.2($1:IN-) R13.2 R14.2
N$97: C27.2 N1.1($1:OUT) R12.2 R13.1
N$98: C28.2 IC4.2(NC) R12.1
N$99: IC3.2(NC) R11.2
N$100: C11.2 IC3.8(NO)
N$101: C11.1 C12.1 R5.1
N$102: C12.2 N1.5($2:IN+) R6.2
N$103: C14.1 N1.7($2:OUT) R5.2 R15.1
N$104: C14.2 IC4.8(NO) R8.1
N$105: C30.1 L4.1 V1.1(G)
N$114: N1.6($2:IN-) R15.2 R16.2
NF1: IC1.1(COM) ; also sheet 4,5
NF2: IC2.1(COM) R10.1 V1.3(D) ; also sheet 3
PB1: C9.1 L2.2 ; also sheet 2
PD0: C29.1 L4.2 ; also sheet 2
PD7: C25.1 L3.2 ; also sheet 2

## Library data of the parts
C1 C2 C9-C36 C39-C49 C54-C57 C59-C61 C63-C69 C101-C108 C201-C206 C208-C212 C214-C218 C220 C221 C224 C228 C301-C303 C305 C307 C403-C407 C409 C413 C418 C419 = resistor:C-EU: CAPACITOR, European symbol
C3-C8 = resistor:C_ARRAY_4X; HERSTELLER: CA064X103K1RACAUTO
C37 C38 C50-C53 = FAST_Kondensatoren:KONDENSATOR_WE_WCAP_PHET_7,3X4,3X1,9MM
C304 = EAGLE-CAPACITORS-rev16a:WCAP-ASLI: WCAP-ASLI Aluminum Electrolytic Capacitors Characteristics Aluminum Electrolytic Capacitor Recommended soldering: Reflow Operating temperature: -55 °C to +105 °C Low impedance product series Load life:2000 h @ +105 °C Package name and Variant abbreviation: Package: Package: B X C X A = length of the solder pad X width of the solder pad X pitch of the solder pad. Variant: D X L = Diameter of the body part X Height of the body part. <http://katalog.we-online.de/media/images/eisos/WCAP-ASLI_pf2.jpg> Details see: http://katalog.we-online.de/en/pbs/WCAP-ASLI?m Created: 2015-03-10 2015 (C) Wurth Elektronik
D1 D2 = 158303260A_Eagle_WL-SWTP_rev20b:WL-SWTP_3030: WL-SWTP SMT White Top view PLCC Characteristics Fast switching No IR radiation High CRI Slim and miniature size Low power consumption Suitable for all SMT assembly methods Top view Wide viewing angle Various of color temperatures LED junction temperature: 130°C Applications Signal lights Indoor displays Backlights General illumination, industrial and commercial lighting systems Decorative and Entertainment lighting Switch lights LED lighting fixtures LED decoration strips Indicator lights and backlighting for wireless mobile devices and consumer electronics Flat backlight for LCD LED backlighting and SMD type indicator lights LED Module Light pipe application Indicator lights and backlighting for consumer and industrial applications Indoor area lighting Downlight Outdoor and architectural lighting systems High bay & Low bay Display & TV Backlight General lighting <https://www.we-online.com/catalog/media/o35241v209%20Family_SWTP_SMD.jpg> Details see: https://www.we-online.com/catalog/en/WL-SWTP/ Updated by Yingchun,Shan,2020-02-23 2020(C) Wurth Elektronik; ABSTRAHLWINKEL: 120°; CCT-TYP: 4000K; CHIP-TECHNOLOGY: AlInGaN; CRI-TYP: 85; DATASHEET-URL: https://www.we-online.com/catalog/datasheet/158303240A.pdf; EMITTING-COLOR: Moonlight; PART-NUMBER: 158303240A; PHI-V-TYP: 36lm; V-F-TYP: 2.8V
D3 D4 = FAST_Dioden:1N4448; HERSTELLER: DIODES; SPANNUNG: 100V; STROM: 500mA; TEMP: -65...150°C
D5-D8 = FAST_Dioden:PESD5V0X1BL,315: Ultra low capacitance bidirectional ElectroStatic Discharge (ESD) protection diode in a SOD882 leadless ultra small Surface-Mounted Device (SMD) plastic package designed to protect one signal line from the damage caused by ESD and other transients.
D301 = fast1:BAT54C: Diode-Dual BAT54C
D302 = Eagle_COLOR_LED (rev17c):WL-SBSW_1204: WL-SBSW SMD Bi-color Side view Waterclear Characteristics Dual color chips Low current requirement Fast switching Side view Compact package outline, very small package for exceptional brightness Applications Indicator LCD illumination as in PDAs, MP3-Players, LCD monitors, LCD televisions Display: Full color video notice board Industry white goods: Oven, Microwave, Refrigerators… Interior applications: switches, telematics, climate control system, dashboard <http://katalog.we-online.de/media/images/v2/Family_WL-SBSW_1204.jpg> Details see: http://katalog.we-online.de/en/led/WL-SBSW Updated 2017-04-14 2017 (C) Wurth Elektronik
D403 D404 = FAST_Dioden:DIODE-: DIODE
H1 = Eagle_WE-SHC (rev21a):WE-SHC_SMD-FRAME: WE-SHC Shielding Cabinet for Standard Applications Characteristics Customizable Product Series: Dimensions Shape (Cabi Base material Plating Tin plate in accordance with DIN EN 10202/10203 Two-part case consisting of a solderable grid frame (SMT/THT) and a removable cover Packaged in Tape&Reel for easy pick&place soldering Applications To prevent EMI radiation from PCB and to keep sensitivity low of: – RF output stages – RF input and amplifier stages – Oscillators – EMC sensitive parts in plastic cases <https://www.we-online.com/catalog/media/o14744v209%20Family_WE-SHC_NEU_2017_bearbeitet.jpg> Details see: https://www.we-online.com/catalog/en/WE-SHC Updated by Ella Wu 2019-06-05 2019 (C) Wurth Elektronik; DATASHEET-URL: https://www.we-online.com/catalog/datasheet/36103205.pdf; HEIGHT: 3mm; LENGTH: 20mm; MOUNT: SMT; PART-NUMBER: 36103205; WIDTH: 20mm
H201 = FAST_Display:AQUAM60: AquaM60 Datenblatt: AquaM60.pdf <D:/Datenblaetter/LCD/AquaM60.pdf> www: www.opto-doll.de • 3,3 V • 64Hz • -10°C .. + 60°C
H401 = led:LED: LED OSRAM: - CHIPLED LG R971, LG N971, LY N971, LG Q971, LY Q971, LO R971, LY R971 LH N974, LH R974 LS Q976, LO Q976, LY Q976 LO Q996 - Hyper CHIPLED LW Q18S LB Q993, LB Q99A, LB R99A - SideLED LS A670, LO A670, LY A670, LG A670, LP A670 LB A673, LV A673, LT A673, LW A673 LH A674 LY A675 LS A676, LA A676, LO A676, LY A676, LW A676 LS A679, LY A679, LG A679 - Hyper Micro SIDELED® LS Y876, LA Y876, LO Y876, LY Y876 LT Y87S - SmartLED LW L88C, LW L88S LB L89C, LB L89S, LG L890 LS L89K, LO L89K, LY L89K LS L896, LA L896, LO L896, LY L896 - TOPLED LS T670, LO T670, LY T670, LG T670, LP T670 LSG T670, LSP T670, LSY T670, LOP T670, LYG T670 LG T671, LOG T671, LSG T671 LB T673, LV T673, LT T673, LW T673 LH T674 LS T676, LA T676, LO T676, LY T676, LB T676, LH T676, LSB T676, LW T676 LB T67C, LV T67C, LT T67C, LS T67K, LO T67K, LY T67K, LW E67C LS E67B, LA E67B, LO E67B, LY E67B, LB E67C, LV E67C, LT E67C LW T67C LS T679, LY T679, LG T679 LS T770, LO T770, LY T770, LG T770, LP T770 LB T773, LV T773, LT T773, LW T773 LH T774 LS E675, LA E675, LY E675, LS T675 LS T776, LA T776, LO T776, LY T776, LB T776 LHGB T686 LT T68C, LB T68C - Hyper Mini TOPLED® LB M676 - Mini TOPLED Santana® LG M470 LS M47K, LO M47K, LY M47K Source: http://www.osram.convergy.de LUXEON: - LUMILED® LXK2-PW12-R00, LXK2-PW12-S00, LXK2-PW14-U00, LXK2-PW14-V00 LXK2-PM12-R00, LXK2-PM12-S00, LXK2-PM14-U00 LXK2-PE12-Q00, LXK2-PE12-R00, LXK2-PE12-S00, LXK2-PE14-T00, LXK2-PE14-U00 LXK2-PB12-K00, LXK2-PB12-L00, LXK2-PB12-M00, LXK2-PB14-N00, LXK2-PB14-P00, LXK2-PB14-Q00 LXK2-PR12-L00, LXK2-PR12-M00, LXK2-PR14-Q00, LXK2-PR14-R00 LXK2-PD12-Q00, LXK2-PD12-R00, LXK2-PD12-S00 LXK2-PH12-R00, LXK2-PH12-S00 LXK2-PL12-P00, LXK2-PL12-Q00, LXK2-PL12-R00 Source: www.luxeon.com KINGBRIGHT: KA-3528ASYC Source: www.kingbright.com; HERSTELLER: LUCKY LIGHT
IC1-IC4 IC201 = FAST_IC:TS12A12511: TS12A12511 Datenblatt: ts12a12511.pdf <D:/Datenblaetter/Switch_IC/ts12a12511.pdf> www: www.TI.com <http://www.ti.com/product/TS12A12511> • ±2.7-V to ±6-V DualSupply • 2.7-V to 12-V SingleSupply • 5-Ω (Typical) ON-State Resistance • 1.6-Ω (Typical) ON-State Resistance Flatness • 3.3-V,5-V Compatible Digital Control Inputs • Rail-to-Rail Analog Signal Handling; HERSTELLER: TI
JP3 = pinhead:PINHD-1X4: PIN HEADER
L1-L4 L201-L205 L209 = resistor:L-EU: INDUCTOR, European symbol
L5 L403-L405 = EagleLibrary_Wuerth_Elektronik_eiSos_V6_20140807:WE-TPC: Shielded Tiny Power Inductor WE-TPC - Extremely flat power inductor - High current capability - High reliability and perfect soldering characteristics because of integrated soldering pad - magnetically shielded -- Portable power like PDA, digital camera, PCMICA-cards and displays -- DC/DC-converter -- Recommended for switching regulator IC's from Linear Technology, National Semiconductor, Texas Instruments and Fairchild Semiconductor <http://katalog.we-online.de/media/images/eisos/IndTPC_pf2.jpg> Details see: http://katalog.we-online.de/en/pbs/WE-TPC? Updated by Dan Xu 2014-07-11 2014 (C) Würth Elektronik; HERSTELLER: Würth
L6-L9 = Eagle_WE-KI (rev21a):WE-KI_0805: WE-KI SMD Wire Wound Ceramic Inductor Characteristics WE-KI series offers you an excellent Q factor and highest possible self resonant frequencies up to 12.5 GHz High quality Inductance tolerances: 2% and 5% High thermal stability Recommended soldering: Reflow Operating temperature: –40°C to +125°C Custom designs on request Applications Especially developed for high frequency applications RF transceiver/communications SAT-Receiver Set Top Box Broadband signal transmission Bluetooth Wireless LAN <https://www.we-online.com/catalog/media/o14799v209%20Family_WE-KI_0402A_744765020A_PMDB.jpg> Details see: https://www.we-online.com/catalog/en/WE-KI Updated by Ella Wu 2021-10-11 2021 (C) Wurth Elektronik; DATASHEET-URL: https://www.we-online.com/catalog/datasheet/744760210A.pdf; FRES: 1200MHz; IR: 500mA; MOUNT: SMT; PART-NUMBER: 744760210A; Q-FACTOR: 60; RDC: 0.43Ohm
L10 L11 = USER:LQW32FT220M0HL: Check availability <https://pricing.snapeda.com/parts/LQW32FT220M0HL/Murata/view-part?ref=eda>; AVAILABILITY: In Stock; DESCRIPTION: Inductor with Inductance: 22uH Tol. +/-20%, Package: 1210 (3225); MF: Murata; MP: LQW32FT220M0HL; PACKAGE: 3225 Murata; PRICE: None; PURCHASE-URL: https://pricing.snapeda.com/search/part/LQW32FT220M0HL/?ref=eda
L301 = EAGLE-POWER_MAGNETICS-rev17a:WE-MAPI: SMD Metal Alloy Power Inductor Characteristics Magnetic iron alloy allows high rated currents Compact design Magnetically shielded High current capability and handles high transient current spikes Low acoustic noise and low leakage flux noise Operating temperature: –40 °C to 125 °C Applications DC/DC-converter for high current power supplies DC/DC-converter for Field Programmable Gate Array (FPGA) POL-converters Portable power like PDA, digital camera Mainboards/graphic cards Battery powered devices Wireless communication devices Power supplies for smartphones, tablet PCs and other mobile devices <http://katalog.we-online.de/media/images/eisos/IndMAPI_pf2.jpg> Details see: http://katalog.we-online.de/en/pbs/WE-MAPI? Updated by Dan Xu 2014-07-08 2014 (C) Wurth Elektronik
M1 = FAST_Module:BM83: Bluetooth Audio BM83 Datenblatt: BM83-Bluetooth-Stereo-Audio-Module-Data-Sheet-DS70005402D.pdf <D:/Datenblaetter/Bluetooth/BM83/BM83-Bluetooth-Stereo-Audio-Module-Data-Sheet-DS70005402D.pdf> Applications Design Guide: 00003118C.pdf <D:/Datenblaetter/Bluetooth/BM83/00003118C.pdf> Errata: MSPK2_v1.2_Release_Notes.pdf <D:/Datenblaetter/Bluetooth/BM83/MSPK2_v1.2_Release_Notes.pdf>; HERSTELLER: Microchip
N1 = FAST_OPV:MCP6V02; DRIFT: +/-50nV/°C; GAIN: 1,3MHz; SPANNUNG: 5,5V; STROM: 300µA; TEMP: -40..125°C; VALUE: MCP6V02-E/SN
N2 = FAST_OPV:OPV_2
N5-N7 = FAST_OPV:OPV_1
N101 = FAST_IC:LSM6DSLTR: LSM6DSLTR Datenblatt: lsm6dsl.pdf <D:/Datenblaetter/Sensor/lsm6dsl.pdf> www: www.st.com <https://www.st.com/en/mems-and-sensors/lsm6dsl.html> • ±2/±4/±8/±16 g full scale • ±125/±245/±500/±1000/±2000 dps full scale • Analog supply voltage: 1.71 V to 3.6 V • Power consumption: 0.4 mA in combo normal mode and 0.65 mA in combo high-performance mode; HERSTELLER: ST
N301 = FAST_BAT_CHG:BQ2409X: BQ24095 Datenblatt: bq24095.pdf <D:/Datenblaetter/Spannungsregler/bq24095.pdf> www: www.ti.com <http://www.ti.com/product/bq24095?qgpn=bq24095> • bq2409x 1A, Single-Input, Single Cell Li-Ion and Li-Pol Battery Charger • V_in = 3.5..12; HERSTELLER: TI; VALUE: BQ2409x
N302 = FAST_Schaltregler:LM3668SD: LM3668 Datenblatt: lm3668.pdf <D:/Datenblaetter/Spannungsregler/lm3668.pdf> www: www.ti.com <http://www.ti.com/product/LM3668/description> • 1A Maximum Load Current for V IN = 2.8 V to 5.5 V • 0,8A Maximum Load Current for V IN = 2.7V • 0,6A Maximum Load Current for V IN = 2.5V • 2,2 MHz Fixed Frequency; HERSTELLER: TI; VALUE: LM3668SD-xxxx/NOPB
N401 = FAST_Schaltregler:LT3471: LT3471 Datenblatt: LT3471fb.pdf <D:/Datenblaetter/Spannungsregler/LT3471fb.pdf> www: www.linear.com <http://www.linear.com/product/LT3471> ■ Dual Micropower DC/DC Converters with Schottky Diodes ■ Input Voltage Range2.4V to 16V ■ Output Voltage Range Up to ±40V; SPICEPREFIX: X
N404 = FAST_Schaltregler:TPS79933: TPS799xx Datenblatt: tps799.pdf <D:/Datenblaetter/Spannungsregler/tps799.pdf> www: www.ti.com <http://www.ti.com/product/TPS799> • 2.7 V to 6.5 V Input Voltage Range • 200 mA Continuous Output Current: V IN ≥ 2.5 V,V OUT = 3.3 V • Device Quiescent Current < 40µA
R1-R3 = resistor:R_ARRAY_8X; HERSTELLER: EXB-U2H103JV
R4-R31 R45 R46 R101 R203 R208-R210 R212 R301-R311 R316-R322 R401-R408 = resistor:R-EU_: RESISTOR, European symbol
R312 R313 = resistor:NTC; HERSTELLER: SEMITEC; VALUE: 103AT-2
R314 R315 = resistor:PTC: PFRA PTC Datenblatt: typ_PFRA.pdf <D:/Datenblaetter/Sicherung/typ_PFRA.pdf> V max 16.0 - 60.0 VDC Imax 40 - 100 A I hold 0.1 - 11 A Mounting PCB,THT Allowable Operation Temp. -40 °C to 85 °C Datenblatt: typ_PFUF.pdf <D:/Datenblaetter/Sicherung/typ_PFUF.pdf> R1210 Datenblatt: typ_USF_0603.pdf <D:/Datenblaetter/Sicherung/typ_USF_0603.pdf> USF 0603
S301 S401 = FAST_Schalter:1301.93XX: Taster 1pol Datenblatt: 1301.93xx.pdf <D:/Datenblaetter/Schalter/1301.93xx.pdf>; HERSTELLER: Schurter; LEISTUNG: 120mW; SPANNUNG: max 30VAC 42VDC; VALUE: 1301.93xx
TP1 TP4 TP5 TP201 TP204-TP206 TP301-TP304 = testpad:TP: Test pad Pad1-12 passt für Oszi-spitze (1,2mm Bohrung)
U101 = atmel-xmega:ATXMEGA64A3: 8/16-bit XMEGA A3 Microcontroller Features High-performance, Low-power 8/16-bit Atmel® AVR® XMEGATM Microcontroller Non-volatile Program and Data Memories – 64 KB - 256 KB of In-System Self-Programmable Flash – 4 KB - 8 KB Boot Code Section with Independent Lock Bits – 2 KB - 4 KB EEPROM – 4 KB - 16 KB Internal SRAM Peripheral Features – Four-channel DMA Controller with support for external requests – Eight-channel Event System – Seven 16-bit Timer/Counters Four Timer/Counters with 4 Output Compare or Input Capture channels Three Timer/Counters with 2 Output Compare or Input Capture channels High Resolution Extensions on all Timer/Counters Advanced Waveform Extension on one Timer/Counter – Seven USARTs IrDA Extension on 1 USART – AES and DES Crypto Engine – Two Two-wire Interfaces with dual address match (I2C and SMBus compatible) – Three SPI (Serial Peripheral Interfaces) – 16-bit Real Time Counter with Separate Oscillator – Two Eight-channel, 12-bit, 2 Msps Analog to Digital Converters – One Two-channel, 12-bit, 1 Msps Digital to Analog Converter – Four Analog Comparators with Window compare function – External Interrupts on all General Purpose I/O pins – Programmable Watchdog Timer with Separate On-chip Ultra Low Power Oscillator Special Microcontroller Features – Power-on Reset and Programmable Brown-out Detection – Internal and External Clock Options with PLL – Programmable Multi-level Interrupt Controller – Sleep Modes: Idle, Power-down, Standby, Power-save, Extended Standby – Advanced Programming, Test and Debugging Interfaces JTAG (IEEE 1149.1 Compliant) Interface for test, debug and programming PDI (Program and Debug Interface) for programming, test and debugging I/O and Packages – 50 Programmable I/O Lines – 64-lead TQFP – 64-pad QFN Operating Voltage – 1.6 – 3.6V Speed performance – 0 – 12 MHz @ 1.6 – 3.6V – 0 – 32 MHz @ 2.7 – 3.6V
U301 U303 = FAST_BAT:55+: Batteriehalter Pin für 1 Zellen AAA SMD Datenblatt: 55.PDF <D:/Datenblaetter/Batteriekontakt/55.PDF> Zylindrische Batteriekontakte, Clips AAA; HERSTELLER: KEYSTONE
U302 U304 = FAST_BAT:55--: Batteriehalter Pin für 1 Zellen AAA SMD Datenblatt: 55.PDF <D:/Datenblaetter/Batteriekontakt/55.PDF> Zylindrische Batteriekontakte, Clips AAA; HERSTELLER: KEYSTONE
V1 V2 V302 V304 V401 = fast-transistor1:N-MOSFET: N-CHANNEL MOS FET SYMBOL
V301 V303 = fast-transistor1:P-MOSFET: P-CHANNEL MOS-FET SYMBOL
X7 = FAST_Stecker:LB1
X102 = fast1:AVRPDI: AVR-PDI-Programmer 4pol.
X302 = FAST_Stecker:USB_3.1_TYPE_C: USB 3.1 Type C Datenblatt: 632723300011.pdf <D:/Datenblaetter/Stecker/632723300011.pdf>; HERSTELLER: Würth

## Net classes
1 V+: width 0.305 mm
3 VCC: width 0.203 mm
4 AGND: clearance 1.016 mm to class 2, clearance 1.016 mm to class 3
5 PE: clearance 1.27 mm to class 0, clearance 1.27 mm to class 1, clearance 1.27 mm to class 2, clearance 1.27 mm to class 3, clearance 1.27 mm to class 4, clearance 1.27 mm